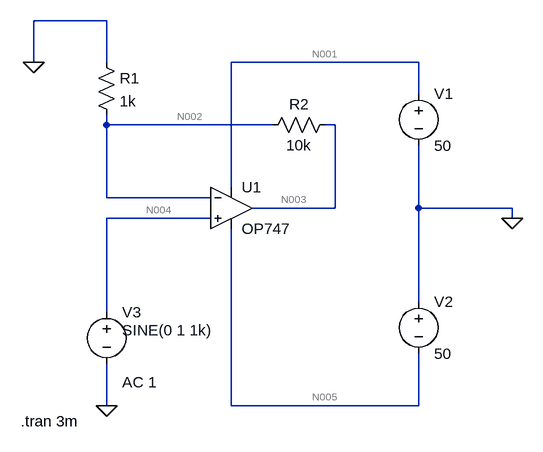
[diagram p0: schematic 4_Zadatak_Lab5.asc]
4_Zadatak_Lab5.asc, the LTspice schematic file:
Version 4
SHEET 1 880 680
WIRE 0 -160 -112 -160
WIRE -112 -96 -112 -160
WIRE 0 -96 0 -160
WIRE 480 -96 192 -96
WIRE 480 -48 480 -96
WIRE 0 0 0 -16
WIRE 256 0 0 0
WIRE 352 0 336 0
WIRE 192 96 192 -96
WIRE 0 112 0 0
WIRE 160 112 0 112
WIRE 352 128 352 0
WIRE 352 128 224 128
WIRE 480 128 480 32
WIRE 624 128 480 128
WIRE 160 144 0 144
WIRE 624 144 624 128
WIRE 480 272 480 128
WIRE 0 288 0 144
WIRE 0 432 0 368
WIRE 192 432 192 160
WIRE 480 432 480 352
WIRE 480 432 192 432
FLAG 0 432 0
FLAG -112 -96 0
FLAG 624 144 0
SYMBOL OpAmps\\OP747 192 64 R0
SYMATTR InstName U1
SYMBOL voltage 480 -64 R0
SYMATTR InstName V1
SYMATTR Value 50
SYMBOL voltage 480 256 R0
SYMATTR InstName V2
SYMATTR Value 50
SYMBOL voltage 0 272 R0
WINDOW 123 24 124 Left 2
WINDOW 39 0 0 Left 0
WINDOW 3 24 44 Left 2
SYMATTR Value2 AC 1
SYMATTR InstName V3
SYMATTR Value SINE(0 1 1k)
SYMBOL res -16 -112 R0
SYMATTR InstName R1
SYMATTR Value 1k
SYMBOL res 352 -16 R90
WINDOW 0 0 56 VBottom 2
WINDOW 3 32 56 VTop 2
SYMATTR InstName R2
SYMATTR Value 10k
TEXT -132 456 Left 2 !.tran 3m

The netlist it stands for:
* 4_Zadatak_Lab5.asc
XU1 N004 N002 N001 N005 N003 OP747  ; pins In+ In- V+ V- OUT
V1 N001 0 50
V2 0 N005 50
V3 N004 0 SINE(0 1 1k) AC 1
R1 0 N002 1k
R2 N003 N002 10k
.tran 3m
.backanno
.end

* Results of the author's LTspice run, read from the files saved beside the schematic
* Operating Point, zero values left out:
*   V(n002) = 80 µV
*   V(n005) = -50 V
*   V(n001) = 50 V
*   V(n003) = 811 µV
*   I(R2) = 73.1 nA
*   I(R1) = -80 nA
*   I(V3) = 8.901 nA
*   I(V2) = -609.8 µA
*   I(V1) = -609.9 µA
*   Ix(u1:1) = -8.901 nA
*   Ix(u1:2) = -6.901 nA
*   Ix(u1:99) = 609.9 µA
*   Ix(u1:50) = -609.8 µA
*   Ix(u1:45) = -73.1 nA
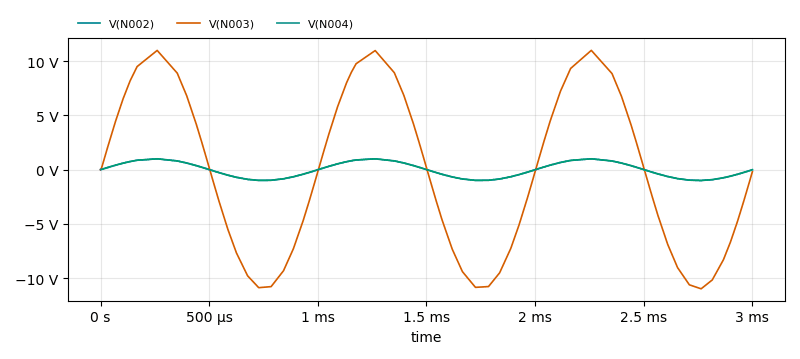
[diagram p1: Transient Analysis of 4_Zadatak_Lab5.asc, plotted from the saved traces]
* Transient Analysis, 1 run:
*   V(N002): min -997.1 mV, max 998.4 mV, average -2.933 mV, rms 700.1 mV, last -16.34 mV
*   V(N003): min -10.97 V, max 10.98 V, average -32.33 mV, rms 7.701 V, last -179.9 mV
*   V(N004): min -996.1 mV, max 997.8 mV, average -3.022 mV, rms 700.2 mV, last 0 V